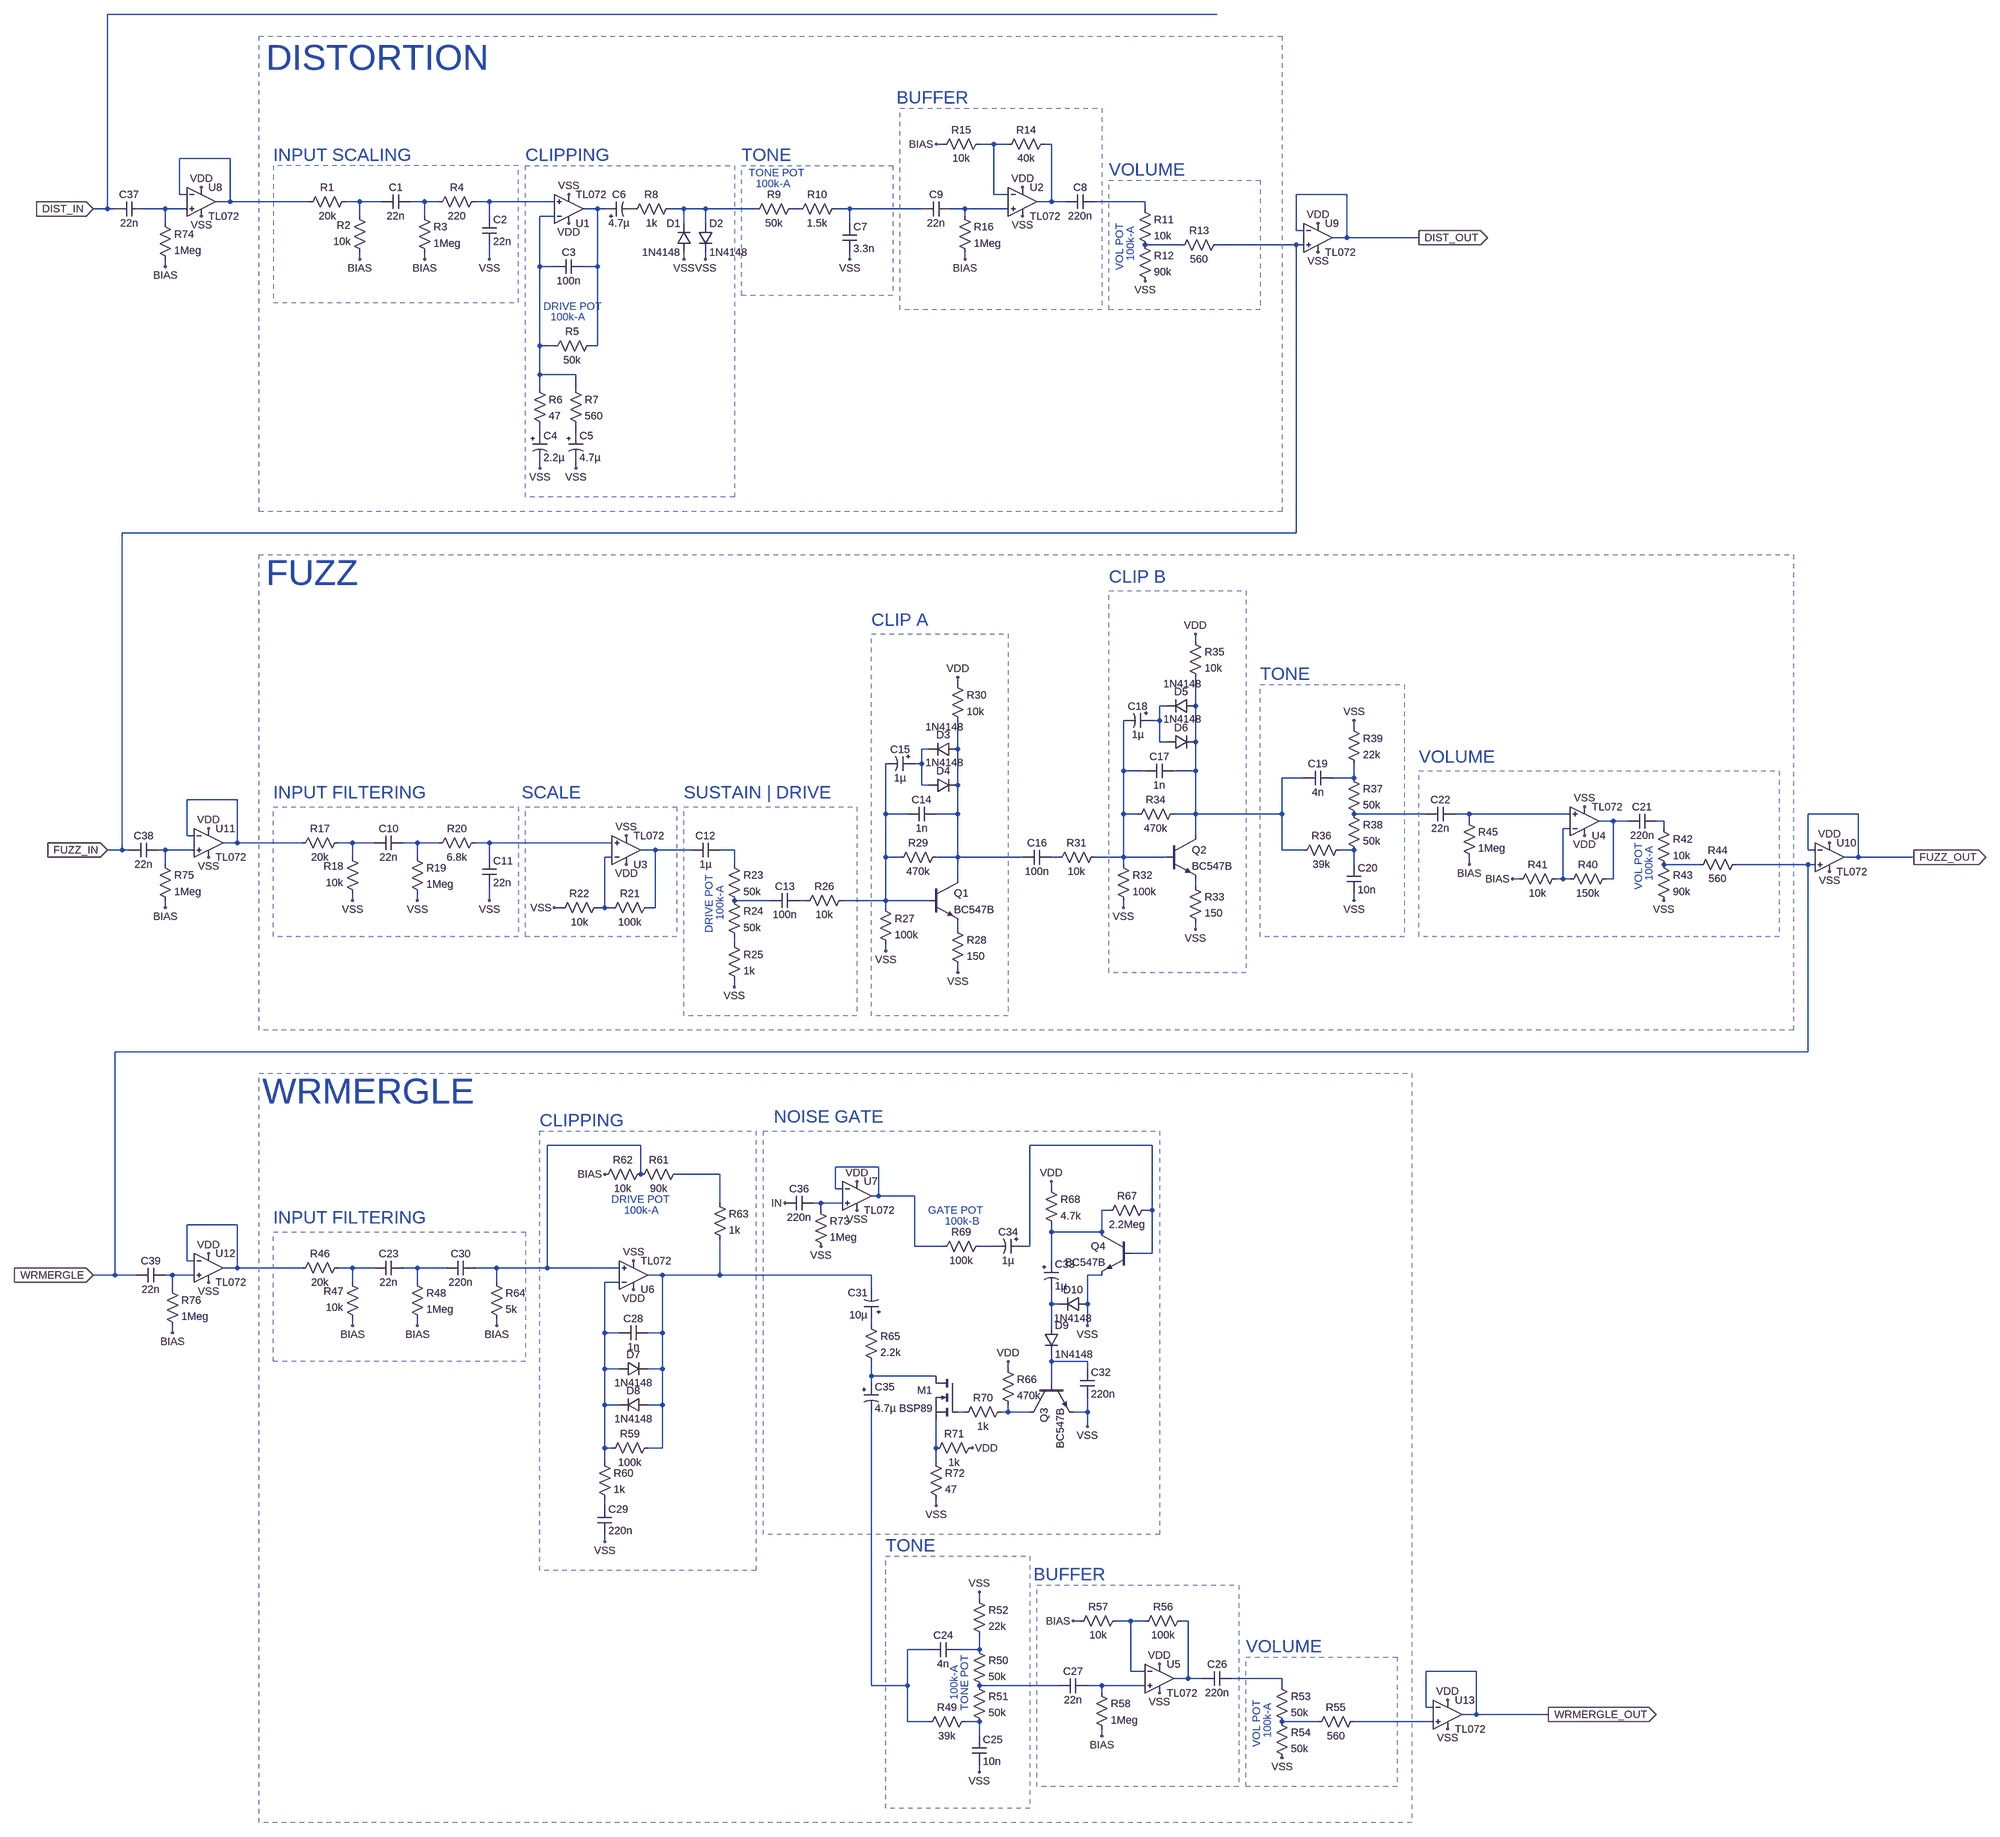
[diagram p0: schematic Draft1.asc]
Draft1.asc, the LTspice schematic file:
Version 4
SHEET 1 2536 2116
WIRE 768 -1904 -1696 -1904
WIRE 160 -1616 144 -1616
WIRE 272 -1616 240 -1616
WIRE 304 -1616 272 -1616
WIRE 400 -1616 384 -1616
WIRE -1424 -1584 -1536 -1584
WIRE -1536 -1504 -1536 -1584
WIRE -1520 -1504 -1536 -1504
WIRE 272 -1504 272 -1616
WIRE 304 -1504 272 -1504
WIRE 1056 -1504 944 -1504
WIRE -1424 -1488 -1424 -1584
WIRE -1424 -1488 -1456 -1488
WIRE -1248 -1488 -1424 -1488
WIRE -1136 -1488 -1168 -1488
WIRE -1088 -1488 -1136 -1488
WIRE -992 -1488 -1024 -1488
WIRE -960 -1488 -992 -1488
WIRE -848 -1488 -880 -1488
WIRE -704 -1488 -848 -1488
WIRE 400 -1488 400 -1616
WIRE 400 -1488 368 -1488
WIRE 432 -1488 400 -1488
WIRE 608 -1488 496 -1488
WIRE -1696 -1472 -1696 -1904
WIRE -1696 -1472 -1728 -1472
WIRE -1680 -1472 -1696 -1472
WIRE -1568 -1472 -1616 -1472
WIRE -1520 -1472 -1568 -1472
WIRE -608 -1472 -640 -1472
WIRE -592 -1472 -608 -1472
WIRE -416 -1472 -448 -1472
WIRE -368 -1472 -416 -1472
WIRE -256 -1472 -368 -1472
WIRE -160 -1472 -176 -1472
WIRE -48 -1472 -80 -1472
WIRE 112 -1472 -48 -1472
WIRE 208 -1472 176 -1472
WIRE 304 -1472 208 -1472
WIRE 608 -1472 608 -1488
WIRE -1136 -1456 -1136 -1488
WIRE -992 -1456 -992 -1488
WIRE -848 -1456 -848 -1488
WIRE -704 -1456 -736 -1456
WIRE 208 -1456 208 -1472
WIRE -1568 -1440 -1568 -1472
WIRE -416 -1440 -416 -1472
WIRE -368 -1440 -368 -1472
WIRE -48 -1440 -48 -1472
WIRE 944 -1424 944 -1504
WIRE 960 -1424 944 -1424
WIRE 1056 -1408 1056 -1504
WIRE 1056 -1408 1024 -1408
WIRE 1216 -1408 1056 -1408
WIRE 688 -1392 608 -1392
WIRE 944 -1392 768 -1392
WIRE 960 -1392 944 -1392
WIRE -1136 -1360 -1136 -1376
WIRE -992 -1360 -992 -1376
WIRE -848 -1360 -848 -1392
WIRE -416 -1360 -416 -1376
WIRE -368 -1360 -368 -1376
WIRE -48 -1360 -48 -1376
WIRE 208 -1360 208 -1376
WIRE -1568 -1344 -1568 -1360
WIRE -736 -1344 -736 -1456
WIRE -704 -1344 -736 -1344
WIRE -608 -1344 -608 -1472
WIRE -608 -1344 -640 -1344
WIRE -736 -1168 -736 -1344
WIRE -704 -1168 -736 -1168
WIRE -608 -1168 -608 -1344
WIRE -608 -1168 -624 -1168
WIRE -736 -1104 -736 -1168
WIRE -656 -1104 -736 -1104
WIRE -736 -1072 -736 -1104
WIRE -656 -1072 -656 -1104
WIRE -736 -976 -736 -992
WIRE -656 -976 -656 -992
WIRE -736 -896 -736 -912
WIRE -656 -896 -656 -912
WIRE 944 -752 944 -1392
WIRE 944 -752 -1664 -752
WIRE 720 -512 720 -528
WIRE 192 -416 192 -432
WIRE 656 -368 640 -368
WIRE 720 -368 720 -432
WIRE 640 -336 640 -368
WIRE 640 -336 624 -336
WIRE 1072 -320 1072 -336
WIRE 640 -288 640 -336
WIRE 656 -288 640 -288
WIRE 720 -288 720 -368
WIRE 128 -272 112 -272
WIRE 192 -272 192 -336
WIRE 112 -240 112 -272
WIRE 112 -240 96 -240
WIRE 560 -224 560 -336
WIRE 608 -224 560 -224
WIRE 720 -224 720 -288
WIRE 720 -224 672 -224
WIRE 960 -208 912 -208
WIRE 1072 -208 1072 -240
WIRE 1072 -208 1024 -208
WIRE 112 -192 112 -240
WIRE 128 -192 112 -192
WIRE 192 -192 192 -272
WIRE -1408 -160 -1520 -160
WIRE 32 -128 32 -240
WIRE 80 -128 32 -128
WIRE 192 -128 192 -192
WIRE 192 -128 144 -128
WIRE 560 -128 560 -224
WIRE 592 -128 560 -128
WIRE 720 -128 720 -224
WIRE 720 -128 672 -128
WIRE 912 -128 912 -208
WIRE 912 -128 720 -128
WIRE 1232 -128 1072 -128
WIRE 1328 -128 1296 -128
WIRE 1552 -128 1328 -128
WIRE 2192 -128 2080 -128
WIRE 1328 -112 1328 -128
WIRE 1648 -112 1616 -112
WIRE 1680 -112 1648 -112
WIRE 1760 -112 1744 -112
WIRE 1552 -96 1536 -96
WIRE 1760 -96 1760 -112
WIRE -1520 -80 -1520 -160
WIRE -1504 -80 -1520 -80
WIRE 720 -80 720 -128
WIRE -1408 -64 -1408 -160
WIRE -1408 -64 -1440 -64
WIRE -1264 -64 -1408 -64
WIRE -1152 -64 -1184 -64
WIRE -1104 -64 -1152 -64
WIRE -1008 -64 -1040 -64
WIRE -960 -64 -1008 -64
WIRE -848 -64 -880 -64
WIRE -576 -64 -848 -64
WIRE -1664 -48 -1664 -752
WIRE -1664 -48 -1696 -48
WIRE -1648 -48 -1664 -48
WIRE -1568 -48 -1584 -48
WIRE -1504 -48 -1568 -48
WIRE -480 -48 -512 -48
WIRE -400 -48 -480 -48
WIRE -304 -48 -336 -48
WIRE 912 -48 912 -128
WIRE 960 -48 912 -48
WIRE 1072 -48 1040 -48
WIRE 2080 -48 2080 -128
WIRE 2096 -48 2080 -48
WIRE -1152 -32 -1152 -64
WIRE -1008 -32 -1008 -64
WIRE -848 -32 -848 -64
WIRE -576 -32 -592 -32
WIRE 32 -32 32 -128
WIRE 64 -32 32 -32
WIRE 192 -32 192 -128
WIRE 192 -32 144 -32
WIRE 336 -32 192 -32
WIRE 416 -32 400 -32
WIRE 560 -32 560 -128
WIRE 560 -32 496 -32
WIRE 656 -32 560 -32
WIRE 2192 -32 2192 -128
WIRE 2192 -32 2160 -32
WIRE 2352 -32 2192 -32
WIRE -1568 -16 -1568 -48
WIRE -304 -16 -304 -48
WIRE 560 -16 560 -32
WIRE 1072 -16 1072 -48
WIRE 1328 -16 1328 -32
WIRE 1840 -16 1760 -16
WIRE 2080 -16 1920 -16
WIRE 2096 -16 2080 -16
WIRE 192 16 192 -32
WIRE 1440 16 1424 16
WIRE 1536 16 1536 -96
WIRE 1536 16 1520 16
WIRE 1552 16 1536 16
WIRE 1648 16 1648 -112
WIRE 1648 16 1632 16
WIRE 720 32 720 16
WIRE -1152 64 -1152 48
WIRE -1008 64 -1008 48
WIRE -848 64 -848 32
WIRE -224 64 -304 64
WIRE -144 64 -160 64
WIRE 32 64 32 -32
WIRE 32 64 -64 64
WIRE 128 64 32 64
WIRE 1072 64 1072 48
WIRE -1568 80 -1568 64
WIRE -688 80 -704 80
WIRE -592 80 -592 -32
WIRE -592 80 -608 80
WIRE -576 80 -592 80
WIRE -480 80 -480 -48
WIRE -480 80 -496 80
WIRE 32 80 32 64
WIRE 560 80 560 64
WIRE 192 128 192 112
WIRE 720 128 720 112
WIRE -304 160 -304 144
WIRE 32 176 32 160
WIRE 192 224 192 208
WIRE -304 256 -304 240
WIRE 2080 400 2080 -16
WIRE 2080 400 -1680 400
WIRE -512 608 -720 608
WIRE 624 608 352 608
WIRE 16 656 -80 656
WIRE -512 672 -512 608
WIRE -336 672 -432 672
WIRE -80 704 -80 656
WIRE -64 704 -80 704
WIRE 400 704 400 688
WIRE 16 720 16 656
WIRE 16 720 0 720
WIRE 96 720 16 720
WIRE -336 736 -336 672
WIRE -112 736 -128 736
WIRE -64 736 -112 736
WIRE -112 752 -112 736
WIRE 528 752 512 752
WIRE 624 752 624 608
WIRE 624 752 608 752
WIRE -1408 784 -1520 784
WIRE 400 800 400 784
WIRE 512 800 512 752
WIRE 512 800 400 800
WIRE 96 832 96 720
WIRE 160 832 96 832
WIRE 272 832 240 832
WIRE 352 832 352 608
WIRE 352 832 336 832
WIRE 624 848 624 752
WIRE 624 848 576 848
WIRE -1520 864 -1520 784
WIRE -1504 864 -1520 864
WIRE 400 864 400 800
WIRE -1408 880 -1408 784
WIRE -1408 880 -1440 880
WIRE -1264 880 -1408 880
WIRE -1152 880 -1184 880
WIRE -1104 880 -1152 880
WIRE -1008 880 -1040 880
WIRE -944 880 -1008 880
WIRE -832 880 -880 880
WIRE -720 880 -720 608
WIRE -720 880 -832 880
WIRE -560 880 -720 880
WIRE -1680 896 -1680 400
WIRE -1680 896 -1728 896
WIRE -1632 896 -1680 896
WIRE -1552 896 -1568 896
WIRE -1504 896 -1552 896
WIRE -464 896 -496 896
WIRE -336 896 -336 816
WIRE -336 896 -464 896
WIRE 0 896 -336 896
WIRE 512 896 480 896
WIRE -1152 912 -1152 880
WIRE -1008 912 -1008 880
WIRE -832 912 -832 880
WIRE -560 912 -592 912
WIRE -1552 928 -1552 896
WIRE 0 928 0 896
WIRE 400 960 400 928
WIRE 416 960 400 960
WIRE 480 960 480 896
WIRE -1152 1008 -1152 992
WIRE -1008 1008 -1008 992
WIRE -832 1008 -832 992
WIRE 0 1008 0 992
WIRE 400 1008 400 960
WIRE 480 1008 480 960
WIRE -1552 1024 -1552 1008
WIRE -592 1024 -592 912
WIRE -560 1024 -592 1024
WIRE -464 1024 -464 896
WIRE -464 1024 -496 1024
WIRE 400 1088 400 1072
WIRE 480 1088 400 1088
WIRE -592 1104 -592 1024
WIRE -560 1104 -592 1104
WIRE -464 1104 -464 1024
WIRE -464 1104 -496 1104
WIRE 304 1104 304 1088
WIRE 480 1104 480 1088
WIRE 0 1120 0 1088
WIRE 144 1120 0 1120
WIRE 0 1136 0 1120
WIRE 400 1136 400 1088
WIRE -592 1184 -592 1104
WIRE -560 1184 -592 1184
WIRE -464 1184 -464 1104
WIRE -464 1184 -496 1184
WIRE 208 1200 192 1200
WIRE 304 1200 304 1184
WIRE 304 1200 288 1200
WIRE 352 1200 304 1200
WIRE 480 1200 480 1168
WIRE 480 1200 448 1200
WIRE 480 1232 480 1200
WIRE -592 1280 -592 1184
WIRE -576 1280 -592 1280
WIRE -464 1280 -464 1184
WIRE -464 1280 -496 1280
WIRE 144 1280 144 1216
WIRE -592 1312 -592 1280
WIRE 144 1312 144 1280
WIRE -592 1408 -592 1392
WIRE 144 1408 144 1392
WIRE -592 1488 -592 1472
WIRE 240 1616 240 1600
WIRE 464 1664 448 1664
WIRE 576 1664 544 1664
WIRE 608 1664 576 1664
WIRE 704 1664 688 1664
WIRE 128 1728 80 1728
WIRE 240 1728 240 1696
WIRE 240 1728 192 1728
WIRE 576 1776 576 1664
WIRE 608 1776 576 1776
WIRE 1344 1776 1232 1776
WIRE 704 1792 704 1664
WIRE 704 1792 672 1792
WIRE 736 1792 704 1792
WIRE 912 1792 800 1792
WIRE 0 1808 0 1200
WIRE 80 1808 80 1728
WIRE 80 1808 0 1808
WIRE 416 1808 240 1808
WIRE 512 1808 480 1808
WIRE 608 1808 512 1808
WIRE 912 1808 912 1792
WIRE 512 1824 512 1808
WIRE 1232 1856 1232 1776
WIRE 1248 1856 1232 1856
WIRE 1344 1872 1344 1776
WIRE 1344 1872 1312 1872
WIRE 1504 1872 1344 1872
WIRE 80 1888 80 1808
WIRE 128 1888 80 1888
WIRE 240 1888 208 1888
WIRE 992 1888 912 1888
WIRE 1248 1888 1072 1888
WIRE 240 1920 240 1888
WIRE 512 1920 512 1904
WIRE 240 2000 240 1984
FLAG -1136 -1360 BIAS
FLAG -992 -1360 BIAS
FLAG -848 -1360 VSS
FLAG -672 -1504 VSS
FLAG -672 -1440 VDD
FLAG -736 -896 VSS
FLAG -656 -896 VSS
FLAG -416 -1360 VSS
FLAG -368 -1360 VSS
FLAG -48 -1360 VSS
FLAG 608 -1312 VSS
FLAG 336 -1520 VDD
FLAG 336 -1456 VSS
FLAG 208 -1360 BIAS
FLAG 144 -1616 BIAS
FLAG -1008 64 VSS
FLAG -1152 64 VSS
FLAG -848 64 VSS
FLAG -704 80 VSS
FLAG -544 -80 VSS
FLAG -544 -16 VDD
FLAG -304 256 VSS
FLAG 32 176 VSS
FLAG 192 224 VSS
FLAG 560 80 VSS
FLAG 720 128 VSS
FLAG 192 -432 VDD
FLAG 720 -528 VDD
FLAG 1072 -336 VSS
FLAG 1072 64 VSS
FLAG 1584 -144 VSS
FLAG 1584 -80 VDD
FLAG 1760 64 VSS
FLAG 1328 -16 BIAS
FLAG 1424 16 BIAS
FLAG -1008 1008 BIAS
FLAG -1152 1008 BIAS
FLAG 240 1600 VSS
FLAG 240 2000 VSS
FLAG 912 1968 VSS
FLAG 640 1760 VDD
FLAG 640 1824 VSS
FLAG 512 1920 BIAS
FLAG 448 1664 BIAS
FLAG -528 864 VSS
FLAG -528 928 VDD
FLAG -592 1488 VSS
FLAG -592 672 BIAS
FLAG -832 1008 BIAS
FLAG 144 1408 VSS
FLAG 304 1088 VDD
FLAG 480 1232 VSS
FLAG 480 1008 VSS
FLAG 400 688 VDD
FLAG -32 688 VDD
FLAG -32 752 VSS
FLAG 224 1280 VDD
FLAG -112 832 VSS
FLAG -192 736 IN
FLAG -1488 -1520 VDD
FLAG -1488 -1456 VSS
FLAG -1728 -1472 DIST_IN
IOPIN -1728 -1472 In
FLAG 992 -1440 VDD
FLAG 992 -1376 VSS
FLAG 1216 -1408 DIST_OUT
IOPIN 1216 -1408 Out
FLAG 2128 -64 VDD
FLAG 2128 0 VSS
FLAG 2352 -32 FUZZ_OUT
IOPIN 2352 -32 Out
FLAG -1472 -96 VDD
FLAG -1472 -32 VSS
FLAG -1696 -48 FUZZ_IN
IOPIN -1696 -48 In
FLAG -1472 848 VDD
FLAG -1472 912 VSS
FLAG -1728 896 WRMERGLE
IOPIN -1728 896 In
FLAG 1280 1840 VDD
FLAG 1280 1904 VSS
FLAG 1504 1872 WRMERGLE_OUT
IOPIN 1504 1872 Out
FLAG -1568 -1344 BIAS
FLAG -1568 80 BIAS
FLAG -1552 1024 BIAS
SYMBOL res -1152 -1504 R90
WINDOW 0 0 56 VBottom 2
WINDOW 3 32 56 VTop 2
SYMATTR InstName R1
SYMATTR Value 20k
SYMBOL res -1120 -1360 R180
WINDOW 0 36 76 Left 2
WINDOW 3 36 40 Left 2
SYMATTR InstName R2
SYMATTR Value 10k
SYMBOL cap -1024 -1504 R90
WINDOW 0 0 32 VBottom 2
WINDOW 3 32 32 VTop 2
SYMATTR InstName C1
SYMATTR Value 22n
SYMBOL res -1008 -1472 R0
SYMATTR InstName R3
SYMATTR Value 1Meg
SYMBOL OpAmps\\opamp2 -672 -1408 M180
SYMATTR InstName U1
SYMATTR Value TL072
SYMBOL res -864 -1504 R90
WINDOW 0 0 56 VBottom 2
WINDOW 3 32 56 VTop 2
SYMATTR InstName R4
SYMATTR Value 220
SYMBOL cap -864 -1456 R0
SYMATTR InstName C2
SYMATTR Value 22n
SYMBOL cap -640 -1360 R90
WINDOW 0 0 32 VBottom 2
WINDOW 3 32 32 VTop 2
SYMATTR InstName C3
SYMATTR Value 100n
SYMBOL res -608 -1184 R90
WINDOW 0 0 56 VBottom 2
WINDOW 3 32 56 VTop 2
SYMATTR InstName R5
SYMATTR Value 50k
SYMBOL res -752 -1088 R0
SYMATTR InstName R6
SYMATTR Value 47
SYMBOL res -672 -1088 R0
SYMATTR InstName R7
SYMATTR Value 560
SYMBOL polcap -752 -976 R0
SYMATTR InstName C4
SYMATTR Value 2.2µ
SYMBOL polcap -672 -976 R0
SYMATTR InstName C5
SYMATTR Value 4.7µ
SYMBOL polcap -592 -1456 R270
WINDOW 0 32 32 VTop 2
WINDOW 3 0 32 VBottom 2
SYMATTR InstName C6
SYMATTR Value 4.7µ
SYMBOL res -432 -1488 R90
WINDOW 0 0 56 VBottom 2
WINDOW 3 32 56 VTop 2
SYMATTR InstName R8
SYMATTR Value 1k
SYMBOL diode -400 -1376 R180
WINDOW 0 24 64 Left 2
WINDOW 3 24 0 Left 2
SYMATTR InstName D1
SYMATTR Value 1N4148
SYMBOL diode -384 -1440 R0
SYMATTR InstName D2
SYMATTR Value 1N4148
SYMBOL res -160 -1488 R90
WINDOW 0 0 56 VBottom 2
WINDOW 3 32 56 VTop 2
SYMATTR InstName R9
SYMATTR Value 50k
SYMBOL res -64 -1488 R90
WINDOW 0 0 56 VBottom 2
WINDOW 3 32 56 VTop 2
SYMATTR InstName R10
SYMATTR Value 1.5k
SYMBOL cap -64 -1440 R0
SYMATTR InstName C7
SYMATTR Value 3.3n
SYMBOL cap 496 -1504 R90
WINDOW 0 0 32 VBottom 2
WINDOW 3 32 32 VTop 2
SYMATTR InstName C8
SYMATTR Value 220n
SYMBOL res 592 -1488 R0
SYMATTR InstName R11
SYMATTR Value 10k
SYMBOL res 592 -1408 R0
SYMATTR InstName R12
SYMATTR Value 90k
SYMBOL res 784 -1408 R90
WINDOW 0 0 56 VBottom 2
WINDOW 3 32 56 VTop 2
SYMATTR InstName R13
SYMATTR Value 560
SYMBOL OpAmps\\opamp2 336 -1552 R0
SYMATTR InstName U2
SYMATTR Value TL072
SYMBOL res 400 -1632 R90
WINDOW 0 0 56 VBottom 2
WINDOW 3 32 56 VTop 2
SYMATTR InstName R14
SYMATTR Value 40k
SYMBOL res 256 -1632 R90
WINDOW 0 0 56 VBottom 2
WINDOW 3 32 56 VTop 2
SYMATTR InstName R15
SYMATTR Value 10k
SYMBOL res 192 -1472 R0
SYMATTR InstName R16
SYMATTR Value 1Meg
SYMBOL cap 176 -1488 R90
WINDOW 0 0 32 VBottom 2
WINDOW 3 32 32 VTop 2
SYMATTR InstName C9
SYMATTR Value 22n
SYMBOL res -1168 -80 R90
WINDOW 0 0 56 VBottom 2
WINDOW 3 32 56 VTop 2
SYMATTR InstName R17
SYMATTR Value 20k
SYMBOL res -1136 64 R180
WINDOW 0 36 76 Left 2
WINDOW 3 36 40 Left 2
SYMATTR InstName R18
SYMATTR Value 10k
SYMBOL cap -1040 -80 R90
WINDOW 0 0 32 VBottom 2
WINDOW 3 32 32 VTop 2
SYMATTR InstName C10
SYMATTR Value 22n
SYMBOL res -1024 -48 R0
SYMATTR InstName R19
SYMATTR Value 1Meg
SYMBOL res -864 -80 R90
WINDOW 0 0 56 VBottom 2
WINDOW 3 32 56 VTop 2
SYMATTR InstName R20
SYMATTR Value 6.8k
SYMBOL cap -864 -32 R0
SYMATTR InstName C11
SYMATTR Value 22n
SYMBOL OpAmps\\opamp2 -544 16 M180
SYMATTR InstName U3
SYMATTR Value TL072
SYMBOL res -480 64 R90
WINDOW 0 0 56 VBottom 2
WINDOW 3 32 56 VTop 2
SYMATTR InstName R21
SYMATTR Value 100k
SYMBOL res -592 64 R90
WINDOW 0 0 56 VBottom 2
WINDOW 3 32 56 VTop 2
SYMATTR InstName R22
SYMATTR Value 10k
SYMBOL cap -336 -64 R90
WINDOW 0 0 32 VBottom 2
WINDOW 3 32 32 VTop 2
SYMATTR InstName C12
SYMATTR Value 1µ
SYMBOL res -320 -32 R0
SYMATTR InstName R23
SYMATTR Value 50k
SYMBOL res -320 48 R0
SYMATTR InstName R24
SYMATTR Value 50k
SYMBOL res -320 144 R0
SYMATTR InstName R25
SYMATTR Value 1k
SYMBOL cap -160 48 R90
WINDOW 0 0 32 VBottom 2
WINDOW 3 32 32 VTop 2
SYMATTR InstName C13
SYMATTR Value 100n
SYMBOL res -48 48 R90
WINDOW 0 0 56 VBottom 2
WINDOW 3 32 56 VTop 2
SYMATTR InstName R26
SYMATTR Value 10k
SYMBOL res 16 64 R0
SYMATTR InstName R27
SYMATTR Value 100k
SYMBOL npn 128 16 R0
SYMATTR InstName Q1
SYMATTR Value BC547B
SYMBOL res 176 112 R0
SYMATTR InstName R28
SYMATTR Value 150
SYMBOL res 160 -48 R90
WINDOW 0 0 56 VBottom 2
WINDOW 3 32 56 VTop 2
SYMATTR InstName R29
SYMATTR Value 470k
SYMBOL cap 144 -144 R90
WINDOW 0 0 32 VBottom 2
WINDOW 3 32 32 VTop 2
SYMATTR InstName C14
SYMATTR Value 1n
SYMBOL polcap 96 -256 R90
WINDOW 0 0 32 VBottom 2
WINDOW 3 32 32 VTop 2
SYMATTR InstName C15
SYMATTR Value 1µ
SYMBOL diode 192 -288 R90
WINDOW 0 0 32 VBottom 2
WINDOW 3 -18 29 VBottom 2
SYMATTR InstName D3
SYMATTR Value 1N4148
SYMBOL diode 128 -176 R270
WINDOW 0 32 32 VTop 2
WINDOW 3 51 35 VTop 2
SYMATTR InstName D4
SYMATTR Value 1N4148
SYMBOL res 176 -432 R0
SYMATTR InstName R30
SYMATTR Value 10k
SYMBOL cap 400 -48 R90
WINDOW 0 0 32 VBottom 2
WINDOW 3 32 32 VTop 2
SYMATTR InstName C16
SYMATTR Value 100n
SYMBOL res 512 -48 R90
WINDOW 0 0 56 VBottom 2
WINDOW 3 32 56 VTop 2
SYMATTR InstName R31
SYMATTR Value 10k
SYMBOL res 544 -32 R0
SYMATTR InstName R32
SYMATTR Value 100k
SYMBOL npn 656 -80 R0
SYMATTR InstName Q2
SYMATTR Value BC547B
SYMBOL res 704 16 R0
SYMATTR InstName R33
SYMATTR Value 150
SYMBOL res 688 -144 R90
WINDOW 0 0 56 VBottom 2
WINDOW 3 32 56 VTop 2
SYMATTR InstName R34
SYMATTR Value 470k
SYMBOL cap 672 -240 R90
WINDOW 0 0 32 VBottom 2
WINDOW 3 32 32 VTop 2
SYMATTR InstName C17
SYMATTR Value 1n
SYMBOL polcap 624 -352 R90
WINDOW 0 0 32 VBottom 2
WINDOW 3 32 32 VTop 2
SYMATTR InstName C18
SYMATTR Value 1µ
SYMBOL diode 720 -384 R90
WINDOW 0 0 32 VBottom 2
WINDOW 3 -18 29 VBottom 2
SYMATTR InstName D5
SYMATTR Value 1N4148
SYMBOL diode 656 -272 R270
WINDOW 0 32 32 VTop 2
WINDOW 3 51 35 VTop 2
SYMATTR InstName D6
SYMATTR Value 1N4148
SYMBOL res 704 -528 R0
SYMATTR InstName R35
SYMATTR Value 10k
SYMBOL res 1056 -64 R90
WINDOW 0 0 56 VBottom 2
WINDOW 3 32 56 VTop 2
SYMATTR InstName R36
SYMATTR Value 39k
SYMBOL cap 1024 -224 R90
WINDOW 0 0 32 VBottom 2
WINDOW 3 32 32 VTop 2
SYMATTR InstName C19
SYMATTR Value 4n
SYMBOL res 1056 -224 R0
SYMATTR InstName R37
SYMATTR Value 50k
SYMBOL res 1056 -144 R0
SYMATTR InstName R38
SYMATTR Value 50k
SYMBOL res 1056 -336 R0
SYMATTR InstName R39
SYMATTR Value 22k
SYMBOL cap 1056 -16 R0
SYMATTR InstName C20
SYMATTR Value 10n
SYMBOL OpAmps\\opamp2 1584 -48 M180
SYMATTR InstName U4
SYMATTR Value TL072
SYMBOL res 1648 0 R90
WINDOW 0 0 56 VBottom 2
WINDOW 3 32 56 VTop 2
SYMATTR InstName R40
SYMATTR Value 150k
SYMBOL res 1536 0 R90
WINDOW 0 0 56 VBottom 2
WINDOW 3 32 56 VTop 2
SYMATTR InstName R41
SYMATTR Value 10k
SYMBOL res 1744 -112 R0
SYMATTR InstName R42
SYMATTR Value 10k
SYMBOL res 1744 -32 R0
SYMATTR InstName R43
SYMATTR Value 90k
SYMBOL res 1936 -32 R90
WINDOW 0 0 56 VBottom 2
WINDOW 3 32 56 VTop 2
SYMATTR InstName R44
SYMATTR Value 560
SYMBOL cap 1744 -128 R90
WINDOW 0 0 32 VBottom 2
WINDOW 3 32 32 VTop 2
SYMATTR InstName C21
SYMATTR Value 220n
SYMBOL res 1312 -128 R0
SYMATTR InstName R45
SYMATTR Value 1Meg
SYMBOL cap 1296 -144 R90
WINDOW 0 0 32 VBottom 2
WINDOW 3 32 32 VTop 2
SYMATTR InstName C22
SYMATTR Value 22n
SYMBOL res -1168 864 R90
WINDOW 0 0 56 VBottom 2
WINDOW 3 32 56 VTop 2
SYMATTR InstName R46
SYMATTR Value 20k
SYMBOL res -1136 1008 R180
WINDOW 0 36 76 Left 2
WINDOW 3 36 40 Left 2
SYMATTR InstName R47
SYMATTR Value 10k
SYMBOL cap -1040 864 R90
WINDOW 0 0 32 VBottom 2
WINDOW 3 32 32 VTop 2
SYMATTR InstName C23
SYMATTR Value 22n
SYMBOL res -1024 896 R0
SYMATTR InstName R48
SYMATTR Value 1Meg
SYMBOL res 224 1872 R90
WINDOW 0 0 56 VBottom 2
WINDOW 3 32 56 VTop 2
SYMATTR InstName R49
SYMATTR Value 39k
SYMBOL cap 192 1712 R90
WINDOW 0 0 32 VBottom 2
WINDOW 3 32 32 VTop 2
SYMATTR InstName C24
SYMATTR Value 4n
SYMBOL res 224 1712 R0
SYMATTR InstName R50
SYMATTR Value 50k
SYMBOL res 224 1792 R0
SYMATTR InstName R51
SYMATTR Value 50k
SYMBOL res 224 1600 R0
SYMATTR InstName R52
SYMATTR Value 22k
SYMBOL cap 224 1920 R0
SYMATTR InstName C25
SYMATTR Value 10n
SYMBOL cap 800 1776 R90
WINDOW 0 0 32 VBottom 2
WINDOW 3 32 32 VTop 2
SYMATTR InstName C26
SYMATTR Value 220n
SYMBOL res 896 1792 R0
SYMATTR InstName R53
SYMATTR Value 50k
SYMBOL res 896 1872 R0
SYMATTR InstName R54
SYMATTR Value 50k
SYMBOL res 1088 1872 R90
WINDOW 0 0 56 VBottom 2
WINDOW 3 32 56 VTop 2
SYMATTR InstName R55
SYMATTR Value 560
SYMBOL OpAmps\\opamp2 640 1728 R0
SYMATTR InstName U5
SYMATTR Value TL072
SYMBOL res 704 1648 R90
WINDOW 0 0 56 VBottom 2
WINDOW 3 32 56 VTop 2
SYMATTR InstName R56
SYMATTR Value 100k
SYMBOL res 560 1648 R90
WINDOW 0 0 56 VBottom 2
WINDOW 3 32 56 VTop 2
SYMATTR InstName R57
SYMATTR Value 10k
SYMBOL res 496 1808 R0
SYMATTR InstName R58
SYMATTR Value 1Meg
SYMBOL cap 480 1792 R90
WINDOW 0 0 32 VBottom 2
WINDOW 3 32 32 VTop 2
SYMATTR InstName C27
SYMATTR Value 22n
SYMBOL OpAmps\\opamp2 -528 960 M180
SYMATTR InstName U6
SYMATTR Value TL072
SYMBOL cap -496 1008 R90
WINDOW 0 0 32 VBottom 2
WINDOW 3 32 32 VTop 2
SYMATTR InstName C28
SYMATTR Value 1n
SYMBOL diode -560 1120 R270
WINDOW 0 32 32 VTop 2
WINDOW 3 0 32 VBottom 2
SYMATTR InstName D7
SYMATTR Value 1N4148
SYMBOL diode -496 1168 R90
WINDOW 0 0 32 VBottom 2
WINDOW 3 32 32 VTop 2
SYMATTR InstName D8
SYMATTR Value 1N4148
SYMBOL res -480 1264 R90
WINDOW 0 0 56 VBottom 2
WINDOW 3 32 56 VTop 2
SYMATTR InstName R59
SYMATTR Value 100k
SYMBOL res -608 1296 R0
SYMATTR InstName R60
SYMATTR Value 1k
SYMBOL cap -608 1408 R0
SYMATTR InstName C29
SYMATTR Value 220n
SYMBOL res -416 656 R90
WINDOW 0 0 56 VBottom 2
WINDOW 3 32 56 VTop 2
SYMATTR InstName R61
SYMATTR Value 90k
SYMBOL res -496 656 R90
WINDOW 0 0 56 VBottom 2
WINDOW 3 32 56 VTop 2
SYMATTR InstName R62
SYMATTR Value 10k
SYMBOL res -352 720 R0
SYMATTR InstName R63
SYMATTR Value 1k
SYMBOL cap -880 864 R90
WINDOW 0 0 32 VBottom 2
WINDOW 3 32 32 VTop 2
SYMATTR InstName C30
SYMATTR Value 220n
SYMBOL res -848 896 R0
SYMATTR InstName R64
SYMATTR Value 5k
SYMBOL polcap 16 992 R180
WINDOW 0 24 57 Left 2
WINDOW 3 24 8 Left 2
SYMATTR InstName C31
SYMATTR Value 10µ
SYMBOL res -16 992 R0
SYMATTR InstName R65
SYMATTR Value 2.2k
SYMBOL nmos 192 1120 M0
SYMATTR InstName M1
SYMATTR Value BSP89
SYMBOL res 288 1088 R0
SYMATTR InstName R66
SYMATTR Value 470k
SYMBOL npn 352 1136 M90
SYMATTR InstName Q3
SYMATTR Value BC547B
SYMBOL cap 464 1104 R0
SYMATTR InstName C32
SYMATTR Value 220n
SYMBOL diode 384 1008 R0
SYMATTR InstName D9
SYMATTR Value 1N4148
SYMBOL diode 480 944 R90
WINDOW 0 0 32 VBottom 2
WINDOW 3 32 32 VTop 2
SYMATTR InstName D10
SYMATTR Value 1N4148
SYMBOL polcap 384 864 R0
SYMATTR InstName C33
SYMATTR Value 1µ
SYMBOL npn 576 800 M0
SYMATTR InstName Q4
SYMATTR Value BC547B
SYMBOL res 624 736 R90
WINDOW 0 0 56 VBottom 2
WINDOW 3 32 56 VTop 2
SYMATTR InstName R67
SYMATTR Value 2.2Meg
SYMBOL res 384 688 R0
SYMATTR InstName R68
SYMATTR Value 4.7k
SYMBOL polcap 336 816 R90
WINDOW 0 0 32 VBottom 2
WINDOW 3 32 32 VTop 2
SYMATTR InstName C34
SYMATTR Value 1µ
SYMBOL res 256 816 R90
WINDOW 0 0 56 VBottom 2
WINDOW 3 32 56 VTop 2
SYMATTR InstName R69
SYMATTR Value 100k
SYMBOL OpAmps\\opamp2 -32 656 R0
SYMATTR InstName U7
SYMATTR Value TL072
SYMBOL polcap -16 1136 R0
SYMATTR InstName C35
SYMATTR Value 4.7µ
SYMBOL res 304 1184 R90
WINDOW 0 0 56 VBottom 2
WINDOW 3 32 56 VTop 2
SYMATTR InstName R70
SYMATTR Value 1k
SYMBOL res 240 1264 R90
WINDOW 0 0 56 VBottom 2
WINDOW 3 32 56 VTop 2
SYMATTR InstName R71
SYMATTR Value 1k
SYMBOL res 128 1296 R0
SYMATTR InstName R72
SYMATTR Value 47
SYMBOL cap -128 720 R90
WINDOW 0 0 32 VBottom 2
WINDOW 3 32 32 VTop 2
SYMATTR InstName C36
SYMATTR Value 220n
SYMBOL res -128 736 R0
SYMATTR InstName R73
SYMATTR Value 1Meg
SYMBOL OpAmps\\opamp2 -1488 -1552 R0
SYMATTR InstName U8
SYMATTR Value TL072
SYMBOL OpAmps\\opamp2 992 -1472 R0
SYMATTR InstName U9
SYMATTR Value TL072
SYMBOL OpAmps\\opamp2 2128 -96 R0
SYMATTR InstName U10
SYMATTR Value TL072
SYMBOL OpAmps\\opamp2 -1472 -128 R0
SYMATTR InstName U11
SYMATTR Value TL072
SYMBOL OpAmps\\opamp2 -1472 816 R0
SYMATTR InstName U12
SYMATTR Value TL072
SYMBOL OpAmps\\opamp2 1280 1808 R0
SYMATTR InstName U13
SYMATTR Value TL072
SYMBOL cap -1616 -1488 R90
WINDOW 0 0 32 VBottom 2
WINDOW 3 32 32 VTop 2
SYMATTR InstName C37
SYMATTR Value 22n
SYMBOL res -1584 -1456 R0
SYMATTR InstName R74
SYMATTR Value 1Meg
SYMBOL cap -1584 -64 R90
WINDOW 0 0 32 VBottom 2
WINDOW 3 32 32 VTop 2
SYMATTR InstName C38
SYMATTR Value 22n
SYMBOL res -1584 -32 R0
SYMATTR InstName R75
SYMATTR Value 1Meg
SYMBOL cap -1568 880 R90
WINDOW 0 0 32 VBottom 2
WINDOW 3 32 32 VTop 2
SYMATTR InstName C39
SYMATTR Value 22n
SYMBOL res -1568 912 R0
SYMATTR InstName R76
SYMATTR Value 1Meg
TEXT -272 -1552 Left 2 ;TONE POT
TEXT -256 -1528 Left 2 ;100k-A
TEXT -728 -1256 Left 2 ;DRIVE POT
TEXT -712 -1232 Left 2 ;100k-A
TEXT -768 -1592 Left 4 ;CLIPPING
TEXT -1328 -1592 Left 4 ;INPUT SCALING
TEXT -288 -1592 Left 4 ;TONE
TEXT 552 -1440 VRight 2 ;VOL POT
TEXT 576 -1432 VRight 2 ;100k-A
TEXT 56 -1720 Left 4 ;BUFFER
TEXT 528 -1560 Left 4 ;VOLUME
TEXT -1344 -1808 Left 6 ;DISTORTION
TEXT -1328 -176 Left 4 ;INPUT FILTERING
TEXT -776 -176 Left 4 ;SCALE
TEXT -360 8 VRight 2 ;DRIVE POT
TEXT -336 32 VRight 2 ;100k-A
TEXT -416 -176 Left 4 ;SUSTAIN | DRIVE
TEXT 0 -560 Left 4 ;CLIP A
TEXT 528 -656 Left 4 ;CLIP B
TEXT 864 -440 Left 4 ;TONE
TEXT 1704 -64 VRight 2 ;VOL POT
TEXT 1728 -56 VRight 2 ;100k-A
TEXT 1216 -256 Left 4 ;VOLUME
TEXT -1344 -664 Left 6 ;FUZZ
TEXT -1328 768 Left 4 ;INPUT FILTERING
TEXT 32 1496 Left 4 ;TONE
TEXT 856 1840 VRight 2 ;VOL POT
TEXT 880 1848 VRight 2 ;100k-A
TEXT 360 1560 Left 4 ;BUFFER
TEXT 832 1720 Left 4 ;VOLUME
TEXT -736 552 Left 4 ;CLIPPING
TEXT -448 728 Right 2 ;DRIVE POT
TEXT -472 752 Right 2 ;100k-A
TEXT 208 1864 VLeft 2 ;TONE POT
TEXT 184 1840 VLeft 2 ;100k-A
TEXT 248 752 Right 2 ;GATE POT
TEXT 240 776 Right 2 ;100k-B
TEXT -216 544 Left 4 ;NOISE GATE
TEXT -1352 488 Left 6 ;WRMERGLE
RECTANGLE Normal -304 -832 -768 -1568 1
RECTANGLE Normal -1328 -1264 -784 -1568 1
RECTANGLE Normal 48 -1280 -288 -1568 1
RECTANGLE Normal 512 -1248 64 -1696 1
RECTANGLE Normal 864 -1248 528 -1536 1
RECTANGLE Normal 912 -800 -1360 -1856 3
RECTANGLE Normal -784 144 -1328 -144 1
RECTANGLE Normal -432 144 -768 -144 1
RECTANGLE Normal -32 320 -416 -144 1
RECTANGLE Normal 304 320 0 -528 1
RECTANGLE Normal 832 224 528 -624 1
RECTANGLE Normal 1184 144 864 -416 1
RECTANGLE Normal 2016 144 1216 -224 1
RECTANGLE Normal 2048 352 -1360 -704 3
RECTANGLE Normal -768 1088 -1328 800 1
RECTANGLE Normal 352 2080 32 1520 1
RECTANGLE Normal 816 2032 368 1584 1
RECTANGLE Normal 1168 2032 832 1744 1
RECTANGLE Normal -256 1552 -736 576 1
RECTANGLE Normal 640 1472 -240 576 1
RECTANGLE Normal 1200 2112 -1360 448 3

The netlist it stands for:
* Draft1.asc
R1 N004 N003 20k
R2 BIAS N004 10k
C1 N005 N004 22n
R3 N005 BIAS 1Meg
XU1 N006 N014 VDD VSS N009 TL072  ; pins In+ In- V+ V- OUT
R4 N006 N005 220
C2 N006 VSS 22n
C3 N009 N014 100n
R5 N009 N014 50k
R6 N014 N016 47
R7 N014 N017 560
C4 N016 VSS 2.2µ
C5 N017 VSS 4.7µ
C6 N009 P001 4.7µ
R8 N010 P001 1k
D1 VSS N010 1N4148
D2 N010 VSS 1N4148
R9 N011 N010 50k
R10 N012 N011 1.5k
C7 N012 VSS 3.3n
C8 N007 N002 220n
R11 N007 N015 10k
R12 N015 VSS 90k
R13 FUZZ_IN N015 560
XU2 N013 N001 VDD VSS N002 TL072  ; pins In+ In- V+ V- OUT
R14 N002 N001 40k
R15 N001 BIAS 10k
R16 N013 BIAS 1Meg
C9 N013 N012 22n
R17 N031 N024 20k
R18 VSS N031 10k
C10 N032 N031 22n
R19 N032 VSS 1Meg
R20 N033 N032 6.8k
C11 N033 VSS 22n
XU3 N033 N038 VDD VSS N035 TL072  ; pins In+ In- V+ V- OUT
R21 N035 N038 100k
R22 N038 VSS 10k
C12 N036 N035 1µ
R23 N036 N042 50k
R24 N042 N045 50k
R25 N045 VSS 1k
C13 N043 N042 100n
R26 N025 N043 10k
R27 N025 VSS 100k
Q1 N021 N025 N044 0 BC547B
R28 N044 VSS 150
R29 N021 N025 470k
C14 N021 N025 1n
C15 N020 N025 1µ
D3 N021 N020 1N4148
D4 N020 N021 1N4148
R30 VDD N021 10k
C16 N039 N021 100n
R31 N022 N039 10k
R32 N022 VSS 100k
Q2 N019 N022 N041 0 BC547B
R33 N041 VSS 150
R34 N019 N022 470k
C17 N019 N022 1n
C18 N018 N022 1µ
D5 N019 N018 1N4148
D6 N018 N019 1N4148
R35 VDD N019 10k
R36 N037 N019 39k
C19 N023 N019 4n
R37 N023 N026 50k
R38 N026 N037 50k
R39 VSS N023 22k
C20 N037 VSS 10n
XU4 N027 N030 VDD VSS N028 TL072  ; pins In+ In- V+ V- OUT
R40 N028 N030 150k
R41 N030 BIAS 10k
R42 N029 N040 10k
R43 N040 VSS 90k
R44 WRMERGLE N040 560
C21 N029 N028 220n
R45 N027 BIAS 1Meg
C22 N027 N026 22n
R46 N054 N052 20k
R47 BIAS N054 10k
C23 N055 N054 22n
R48 N055 BIAS 1Meg
R49 N074 N069 39k
C24 N070 N069 4n
R50 N070 N072 50k
R51 N072 N074 50k
R52 VSS N070 22k
C25 N074 VSS 10n
C26 N071 N068 220n
R53 N071 N075 50k
R54 N075 VSS 50k
R55 N076 N075 560
XU5 N073 N067 VDD VSS N068 TL072  ; pins In+ In- V+ V- OUT
R56 N068 N067 100k
R57 N067 BIAS 10k
R58 N073 BIAS 1Meg
C27 N073 N072 22n
XU6 N046 N058 VDD VSS N057 TL072  ; pins In+ In- V+ V- OUT
C28 N057 N058 1n
D7 N058 N057 1N4148
D8 N057 N058 1N4148
R59 N057 N058 100k
R60 N058 N066 1k
C29 N066 VSS 220n
R61 N049 N046 90k
R62 N046 BIAS 10k
R63 N049 N057 1k
C30 N046 N055 220n
R64 N046 BIAS 5k
C31 N060 N057 10µ
R65 N060 N062 2.2k
M1 N062 N063 N065 N065 BSP89
R66 VDD N064 470k
Q3 N064 N061 VSS 0 BC547B
C32 N061 VSS 220n
D9 N059 N061 1N4148
D10 VSS N059 1N4148
C33 N051 N059 1µ
Q4 N051 N047 VSS 0 BC547B
R67 N047 N051 2.2Meg
R68 VDD N051 4.7k
C34 N047 N053 1µ
R69 N053 N048 100k
XU7 N050 N048 VDD VSS N048 TL072  ; pins In+ In- V+ V- OUT
C35 N062 N069 4.7µ
R70 N064 N063 1k
R71 VDD N065 1k
R72 N065 VSS 47
C36 N050 IN 220n
R73 N050 VSS 1Meg
XU8 N008 N003 VDD VSS N003 TL072  ; pins In+ In- V+ V- OUT
XU9 FUZZ_IN DIST_OUT VDD VSS DIST_OUT TL072  ; pins In+ In- V+ V- OUT
XU10 WRMERGLE FUZZ_OUT VDD VSS FUZZ_OUT TL072  ; pins In+ In- V+ V- OUT
XU11 N034 N024 VDD VSS N024 TL072  ; pins In+ In- V+ V- OUT
XU12 N056 N052 VDD VSS N052 TL072  ; pins In+ In- V+ V- OUT
XU13 N076 WRMERGLE_OUT VDD VSS WRMERGLE_OUT TL072  ; pins In+ In- V+ V- OUT
C37 N008 DIST_IN 22n
R74 N008 BIAS 1Meg
C38 N034 FUZZ_IN 22n
R75 N034 BIAS 1Meg
C39 N056 WRMERGLE 22n
R76 N056 BIAS 1Meg
.model D D
.lib standard.dio
.model NPN NPN
.model PNP PNP
.lib standard.bjt
.model NMOS NMOS
.model PMOS PMOS
.lib standard.mos
* TONE POT
* 100k-A
* DRIVE POT
* 100k-A
* CLIPPING
* INPUT SCALING
* TONE
* VOL POT
* 100k-A
* BUFFER
* VOLUME
* DISTORTION
* INPUT FILTERING
* SCALE
* DRIVE POT
* 100k-A
* SUSTAIN | DRIVE
* CLIP A
* CLIP B
* TONE
* VOL POT
* 100k-A
* VOLUME
* FUZZ
* INPUT FILTERING
* TONE
* VOL POT
* 100k-A
* BUFFER
* VOLUME
* CLIPPING
* DRIVE POT
* 100k-A
* TONE POT
* 100k-A
* GATE POT
* 100k-B
* NOISE GATE
* WRMERGLE
.backanno
.end